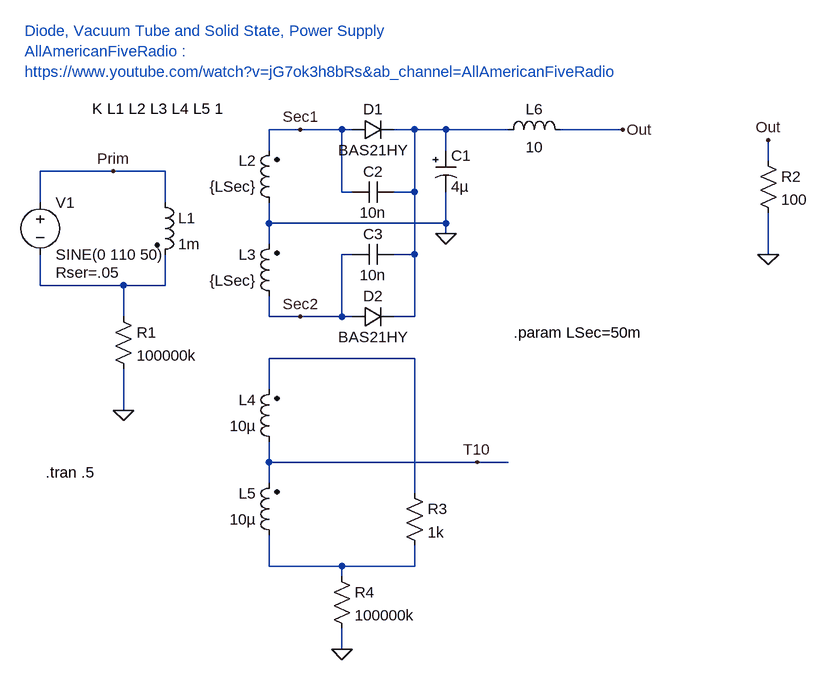
[diagram p0: schematic Ferrix-BL4-4.asc]
Ferrix-BL4-4.asc, the LTspice schematic file:
Version 4
SHEET 1 1136 852
WIRE 352 0 304 0
WIRE 416 0 352 0
WIRE 432 0 416 0
WIRE 528 0 496 0
WIRE 576 0 528 0
WIRE 672 0 576 0
WIRE 848 0 752 0
WIRE 304 32 304 0
WIRE 576 32 576 0
WIRE 1072 48 1072 16
WIRE 64 64 -48 64
WIRE 144 64 64 64
WIRE 416 96 416 0
WIRE 432 96 416 96
WIRE 528 96 528 0
WIRE 528 96 496 96
WIRE -48 112 -48 64
WIRE 144 112 144 64
WIRE 304 144 304 112
WIRE 576 144 576 96
WIRE 576 144 304 144
WIRE 576 160 576 144
WIRE 304 176 304 144
WIRE 432 192 416 192
WIRE 528 192 528 96
WIRE 528 192 496 192
WIRE 1072 192 1072 128
WIRE -48 240 -48 192
WIRE 80 240 -48 240
WIRE 144 240 144 192
WIRE 144 240 80 240
WIRE 80 288 80 240
WIRE 304 288 304 256
WIRE 352 288 304 288
WIRE 416 288 416 192
WIRE 416 288 352 288
WIRE 432 288 416 288
WIRE 528 288 528 192
WIRE 528 288 496 288
WIRE 528 352 304 352
WIRE 304 400 304 352
WIRE 80 432 80 368
WIRE 304 512 304 480
WIRE 624 512 304 512
WIRE 672 512 624 512
WIRE 304 544 304 512
WIRE 528 560 528 352
WIRE 304 672 304 624
WIRE 416 672 304 672
WIRE 528 672 528 640
WIRE 528 672 416 672
WIRE 416 688 416 672
WIRE 416 800 416 768
FLAG 80 432 0
FLAG 64 64 Prim
FLAG 352 0 Sec1
FLAG 352 288 Sec2
FLAG 416 800 0
FLAG 624 512 T10
FLAG 576 160 0
FLAG 1072 192 0
FLAG 1072 16 Out
FLAG 848 0 Out
SYMBOL ind2 128 96 R0
SYMATTR InstName L1
SYMATTR Value 1m
SYMBOL ind2 320 128 R180
WINDOW 0 36 80 Left 2
WINDOW 3 36 40 Left 2
SYMATTR InstName L2
SYMATTR Value {LSec}
SYMBOL ind2 320 272 R180
WINDOW 0 36 80 Left 2
WINDOW 3 36 40 Left 2
SYMATTR InstName L3
SYMATTR Value {LSec}
SYMBOL voltage -48 96 R0
WINDOW 123 0 0 Left 0
WINDOW 39 24 124 Left 2
SYMATTR SpiceLine Rser=.05
SYMATTR InstName V1
SYMATTR Value SINE(0 110 50)
SYMBOL res 64 272 R0
SYMATTR InstName R1
SYMATTR Value 100000k
SYMBOL diode 432 16 R270
WINDOW 0 32 32 VTop 2
WINDOW 3 0 32 VBottom 2
SYMATTR InstName D1
SYMATTR Value BAS21HY
SYMBOL diode 432 304 R270
WINDOW 0 32 32 VTop 2
WINDOW 3 0 32 VBottom 2
SYMATTR InstName D2
SYMATTR Value BAS21HY
SYMBOL ind2 320 496 R180
WINDOW 0 36 80 Left 2
WINDOW 3 36 40 Left 2
SYMATTR InstName L4
SYMATTR Value 10µ
SYMBOL ind2 320 640 R180
WINDOW 0 36 80 Left 2
WINDOW 3 36 40 Left 2
SYMATTR InstName L5
SYMATTR Value 10µ
SYMBOL res 512 544 R0
SYMATTR InstName R3
SYMATTR Value 1k
SYMBOL res 400 672 R0
SYMATTR InstName R4
SYMATTR Value 100000k
SYMBOL polcap 560 32 R0
SYMATTR InstName C1
SYMATTR Value 4µ
SYMBOL ind 656 16 R270
WINDOW 0 32 56 VTop 2
WINDOW 3 5 56 VBottom 2
SYMATTR InstName L6
SYMATTR Value 10
SYMBOL cap 496 80 R90
WINDOW 0 0 32 VBottom 2
WINDOW 3 32 32 VTop 2
SYMATTR InstName C2
SYMATTR Value 10n
SYMBOL cap 496 176 R90
WINDOW 0 0 32 VBottom 2
WINDOW 3 32 32 VTop 2
SYMATTR InstName C3
SYMATTR Value 10n
SYMBOL res 1056 32 R0
SYMATTR InstName R2
SYMATTR Value 100
TEXT 32 -32 Left 2 !K L1 L2 L3 L4 L5 1
TEXT -40 528 Left 2 !.tran .5
TEXT -72 -152 Left 2 ;Diode, Vacuum Tube and Solid State, Power Supply \nAllAmericanFiveRadio : \nhttps://www.youtube.com/watch?v=jG7ok3h8bRs&ab_channel=AllAmericanFiveRadio
TEXT 680 312 Left 2 !.param LSec=50m

The netlist it stands for:
* Ferrix-BL4-4.asc
L1 Prim N002 1m
L2 0 Sec1 {LSec}
L3 Sec2 0 {LSec}
V1 Prim N002 SINE(0 110 50) Rser=.05
R1 N002 0 100000k
D1 Sec1 N001 BAS21HY
D2 Sec2 N001 BAS21HY
L4 T10 N003 10µ
L5 N004 T10 10µ
R3 N003 N004 1k
R4 N004 0 100000k
C1 N001 0 4µ
L6 N001 Out 10
C2 N001 Sec1 10n
C3 N001 Sec2 10n
R2 Out 0 100
.model D D
.lib standard.dio
K L1 L2 L3 L4 L5 1
.tran .5
* Diode, Vacuum Tube and Solid State, Power Supply
* AllAmericanFiveRadio :
* https://www.youtube.com/watch?v=jG7ok3h8bRs&ab_channel=AllAmericanFiveRadio
.param LSec=50m
.backanno
.end